# Altium schematic sheet bqZUM_PowerManager.SchDoc: Power Manager
size A4; Author: bq; CompanyName: bq - Mundo Reader; Organization: bq - Mundo Reader; DocumentNumber: 5; Revision: 0; SheetNumber: 5; SheetTotal: 8; ProjectName: bqduino
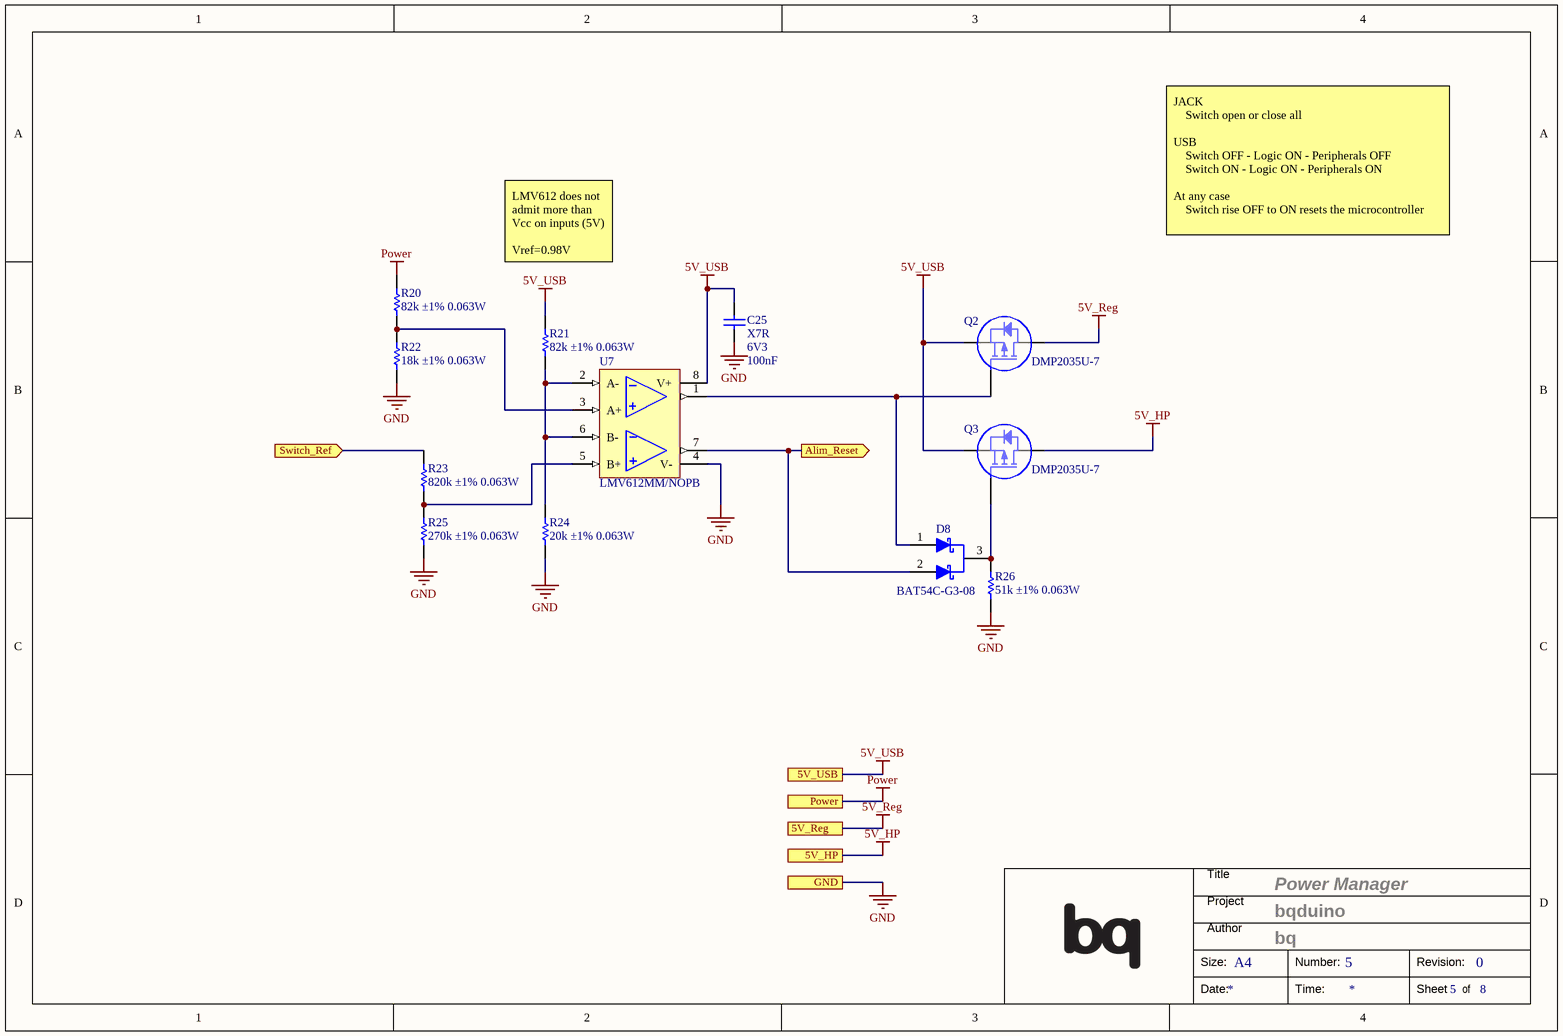
[diagram p0: bqZUM_PowerManager.SchDoc]

## Parts
C25  Dielectric: X7R  Voltage: 6V3  Capacitance: 100nF  [C0402]  (hidden comment: Capacitor)
D8  BAT54C-G3-08  [SOT23-3]
Q2  DMP2035U-7  [SOT23-3]
Q3  DMP2035U-7  [SOT23-3]
R20  value 82k ±1% 0.063W  [R0402]  (hidden comment: Resistor)
R21  value 82k ±1% 0.063W  [R0402]  (hidden comment: Resistor)
R22  value 18k ±1% 0.063W  [R0402]  (hidden comment: Resistor)
R23  value 820k ±1% 0.063W  [R0402]  (hidden comment: Resistor)
R24  value 20k ±1% 0.063W  [R0402]  (hidden comment: Resistor)
R25  value 270k ±1% 0.063W  [R0402]  (hidden comment: Resistor)
R26  value 51k ±1% 0.063W  [R0402]  (hidden comment: Resistor)
U7  LMV612MM/NOPB  [VSSOP8]

## Ports
5V_HP, 5V_Reg, 5V_USB, Alim_Reset (out), GND, Power, Switch_Ref (in)

## Nets
5V_HP: Q3.3(D) ; port 5V_HP
5V_Reg: Q2.3(D) ; port 5V_Reg
5V_USB: C25.1 Q2.2(S) Q3.2(S) R21.2 U7.8(V+) ; port 5V_USB
GND: C25.2 R22.1 R24.1 R25.1 R26.1 U7.4(V-) ; port GND
Power: R20.2 ; port Power
Alim_Reset: D8.2(A2) U7.7(Out2) ; port Alim_Reset
Switch_Ref: R23.2 ; port Switch_Ref
NetD8_1: D8.1(A1) Q2.1(G) U7.1(Out)
NetD8_3: D8.3(K) Q3.1(G) R26.2
NetR20_1: R20.1 R22.2 U7.3(A+)
NetR21_1: R21.1 R24.2 U7.2(A-) U7.6(B-)
NetR23_1: R23.1 R25.2 U7.5(B+)

## Notes on the sheet
- JACK
  Switch open or close all
  USB
  Switch OFF - Logic ON - Peripherals OFF
  Switch ON - Logic ON - Peripherals ON
  At any case
  Switch rise OFF to ON resets the microcontroller
- LMV612 does not admit more than Vcc on inputs (5V)
  Vref=0.98V
- Title
- Project
- Size:
- Author
- A4
- Number:
- Revision:
- Date:
- Time:
- Sheet
- of

## Library data of the parts
C25 = C0402_100nF_6V3_±10%: Manufacturer: Kemet; Value: 100nF ±10% 6V3; Tolerance: ±10%; OrderingCode: C0402C104K9RAC; Temp_ Max: 125; Temp_ Min: -55; Part Number: C0402_100nF_6V3_±10%; Price (€): 0,011
D8 = BAT54C: Dual Schottky Diode Common Cathode; Part Number: BAT54C; Manufacturer: Vishay; Ifor: 200mA; Vrrm: 30V; Ifsm: 600mA; Vf: 0,8V; Temp_ Max: 125; Temp_ Min: -55; Value: 200mA 30V; OrderingCode: BAT54C-G3-08; Price (€): 0,042
Q2 Q3 = DMP2035U: Mosfet Channel P Enhancement Mode; Manufacturer: Diodes Incorporated; Vds: 20V; Vgss: 8V; Id: 3,6A; Temp_ Max: 150; Temp_ Min: -55; Part Number: DMP2035U; OrderingCode: DMP2035U-7; Supplier: Silica; Price (€): 0,08
R20 R21 = R0402_82k_0.063W_±1%: Manufacturer: Vishay; Tolerance: ±1%; OrderingCode: CRCW040282K0FK; Power: 0.063W; Resistance: 82k; Temp_ Max: 155; Temp_ Min: -55; PackageDescription: SMD; Part Number: R0402_82k_0.063W_±1%; Price (€): 0,006
R22 = R0402_18k_0.063W_±1%: Manufacturer: Vishay; Tolerance: ±1%; OrderingCode: CRCW040218K0FK; Power: 0.063W; Resistance: 18k; Temp_ Max: 155; Temp_ Min: -55; PackageDescription: SMD; Part Number: R0402_18k_0.063W_±1%; Price (€): 0,006
R23 = R0402_820k_0.063W_±1%: Manufacturer: Vishay; Tolerance: ±1%; OrderingCode: CRCW0402820KFK; Power: 0.063W; Resistance: 820k; Temp_ Max: 155; Temp_ Min: -55; PackageDescription: SMD; Part Number: R0402_820k_0.063W_±1%; Price (€): 0,006
R24 = R0402_20k_0.063W_±1%: Manufacturer: Vishay; Tolerance: ±1%; OrderingCode: CRCW040220K0FK; Power: 0.063W; Resistance: 20k; Temp_ Max: 155; Temp_ Min: -55; PackageDescription: SMD; Part Number: R0402_20k_0.063W_±1%; Price (€): 0,006
R25 = R0402_270k_0.063W_±1%: Manufacturer: Vishay; Tolerance: ±1%; OrderingCode: CRCW0402270KFK; Power: 0.063W; Resistance: 270k; Temp_ Max: 155; Temp_ Min: -55; PackageDescription: SMD; Part Number: R0402_270k_0.063W_±1%; Price (€): 0,006
R26 = R0402_51k_0.063W_±1%: Manufacturer: Vishay; Tolerance: ±1%; OrderingCode: CRCW040251K0FK; Power: 0.063W; Resistance: 51k; Temp_ Max: 155; Temp_ Min: -55; PackageDescription: SMD; Part Number: R0402_51k_0.063W_±1%; Price (€): 0,006
U7 = LMV612: Dual Operational Amplifier; Manufacturer: Texas Instruments; Vdc: 5,5 Vdc; Temp_ Max: 125; Temp_ Min: -40; Part Number: LMV612; OrderingCode: LMV612MM/NOPB; Supplier: Silica; Price (€): 0,274